# Altium schematic sheet Sheet1.SchDoc
size A4
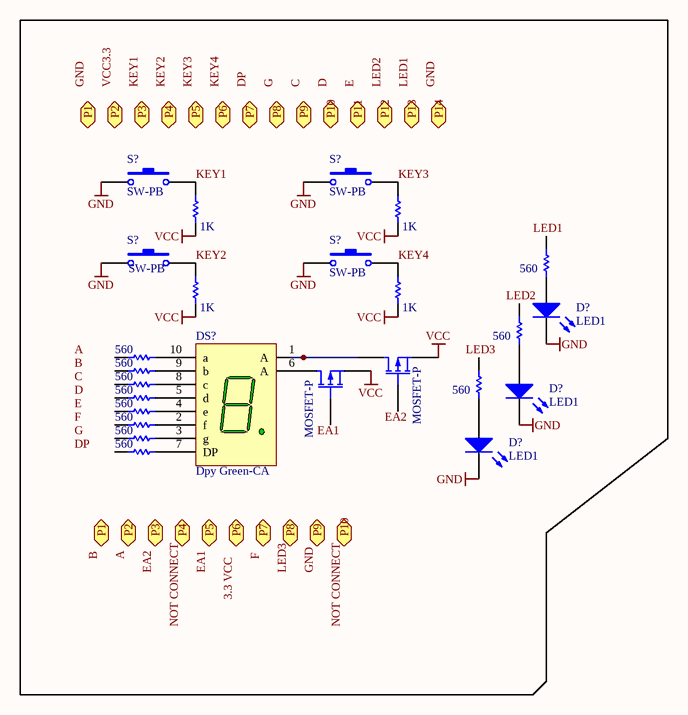
[diagram p0: Sheet1.SchDoc]

## Parts
(Parts that share a designator on the sheet are numbered #1, #2 ... from top to bottom, then left to right.)
?#1  value 1K  [AXIAL-0.3]
?#2  value 1K  [AXIAL-0.3]
?#3  value 1K  [AXIAL-0.3]
?#4  value 1K  [AXIAL-0.3]
?#5  value 560  [AXIAL-0.5]
?#6  value 560  [AXIAL-0.5]
?#7  value 560  [AXIAL-0.5]
?#8  value 560  [AXIAL-0.5]
?#9  value 560  [AXIAL-0.5]
?#10  value 560  [AXIAL-0.5]
?#11  MOSFET-P  [E3]
?#12  value 560  [AXIAL-0.5]
?#13  MOSFET-P  [E3]
?#14  value 560  [AXIAL-0.5]
?#15  value 560  [AXIAL-0.5]
?#16  value 560  [AXIAL-0.5]
?#17  value 560  [AXIAL-0.5]
D?#1  LED1  [LED-1]
D?#2  LED1  [LED-1]
D?#3  LED1  [LED-1]
DS?  Dpy Green-CA  [A]
S?#1  SW-PB  [SPST-2]
S?#2  SW-PB  [SPST-2]
S?#3  SW-PB  [SPST-2]
S?#4  SW-PB  [SPST-2]

## Ports
P1, P2, P3, P4, P5, P6, P7, P8, P9, P10, P11, P12, P13, P14

## Nets
GND: D?#1.2(K) D?#2.2(K) D?#3.2(K) S?#1.1 S?#2.1 S?#3.1 S?#4.1
VCC: ?#1.2 ?#2.2 ?#3.2 ?#4.2 ?#11.3(S) ?#13.3(S)
KEY1: ?#1.1 S?#1.2
KEY2: ?#3.1 S?#3.2
KEY3: ?#2.1 S?#2.2
KEY4: ?#4.1 S?#4.2
Net?#6_2: ?#6.2 DS?.10(a)
Net?#7_1: ?#7.1 D?#2.1(A)
Net?#8_2: ?#8.2 DS?.9(b)
Net?#9_2: ?#9.2 DS?.8(c)
Net?#10_2: ?#10.2 DS?.5(d)
Net?#11_1: ?#11.1(D) DS?.1(A)
Net?#12_2: ?#12.2 DS?.4(e)
Net?#14_1: ?#14.1 D?#3.1(A)
Net?#15_2: ?#15.2 DS?.2(f)
Net?#16_2: ?#16.2 DS?.3(g)
Net?#17_2: ?#17.2 DS?.7(DP)

Not connected (* = marked no-connect by the designer): ?#5 1 2; ?#6 1; ?#7 2; ?#8 1; ?#9 1; ?#10 1; ?#11 2(G); ?#12 1; ?#13 1(D) 2(G); ?#14 2; ?#15 1; ?#16 1; ?#17 1; D?#1 1(A); DS? 6(A)

## Notes on the sheet
- Labels drawn without touching a wire or pin: 3.3 VCC, A, B, C, D, DP, E, EA1, EA2, F, G, GND, KEY1, KEY2, KEY3, KEY4, LED1, LED2, LED3, NOT CONNECT, VCC3.3

## Library data of the parts
?#1-?#4 = Res1: Resistor; Published: 8-Jun-2000; LatestRevisionDate: 17-Jul-2002; LatestRevisionNote: Re-released for DXP Platform.; PackageReference: AXIAL-0.3; Publisher: Altium Limited; PackageDescription: Axial Device, Thru-Hole; 2 Leads; 0.3 in Pin Spacing
?#5-?#10 ?#12 ?#14-?#17 = Res Semi: Semiconductor Resistor; Published: 8-Jun-2000; LatestRevisionDate: 17-Jul-2002; LatestRevisionNote: Re-released for DXP Platform.; PackageReference: AXIAL-0.5; Publisher: Altium Limited; PackageDescription: Axial Device, Thru-Hole; 2 Leads; 0.5 in Pin Spacing
?#11 ?#13 = MOSFET-P: P-Channel MOSFET; Published: 8-Jun-2000; LatestRevisionDate: 17-Jul-2002; LatestRevisionNote: Re-released for DXP Platform.; PackageVersion: 1995/1996; PackageReference: E3; Publisher: Altium Limited; PackageDescription: TO, Flat Index; 3 In-Line, Axial Leads; Body Dia. 4.6mm; Lead Dia. 0.5 mm (max)
D?#1-D?#3 = LED1: Typical RED GaAs LED; Published: 8-Jun-2000; LatestRevisionDate: 08-Jul-2005; LatestRevisionNote: Mech Layer 1 removed.; PackageReference: LED-1; Publisher: Altium Limited; PackageDescription: LED; 2 Leads
DS? = Dpy Green-CA: 7.62 mm Black Surface Green 7-Segment Display: CA, RH DP; MinimumIntensity: 860 ucd; Note: IF = 10 mA; Note: Pins 1 and 6 are redundant Anodes.; Published: 8-Jun-2000; LatestRevisionDate: 17-Dec-2003; LatestRevisionNote: Schematic revised, PCB Footprint replaced.; DatasheetVersion: 19-Feb-2002; PackageVersion: 11-Feb-2002; PackageReference: A; Publisher: Altium Limited; PackageDescription: LED, 7-Segment Display, 7.62 mm, RHD; 10 Leads; Row Space 5.08 mm; Pitch 2.54 mm; Colour: Green; ComponentLink1Description: Manufacturer Link; ComponentLink1URL: http://www.agilent.com/
S?#1-S?#4 = SW-PB: Switch; Published: 24-Mar-1999; LatestRevisionDate: 17-Jul-2002; LatestRevisionNote: Re-released for DXP Platform.; PackageReference: SPST-2; Publisher: Altium Limited; PackageDescription: Switch; 2 Leads